# Altium schematic sheet sheet.SchDoc
size A4
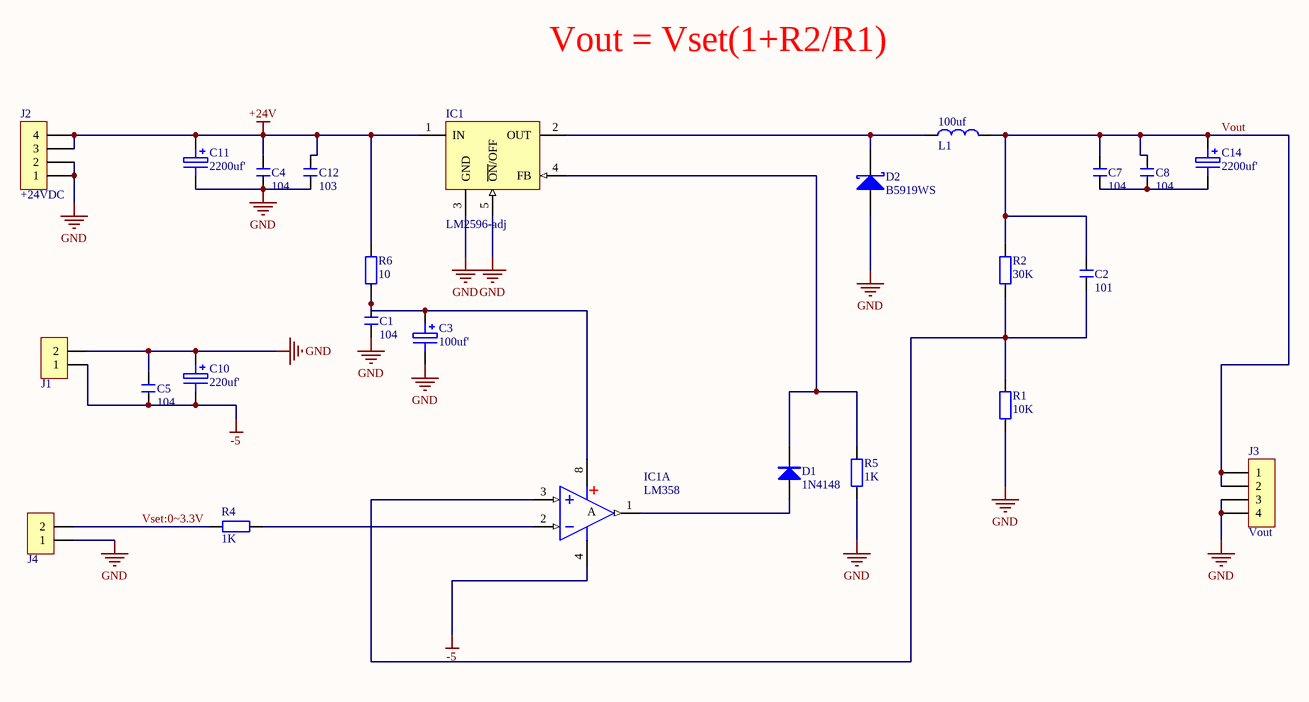
[diagram p0: sheet.SchDoc]

## Parts
(Parts that share a designator on the sheet are numbered #1, #2 ... from top to bottom, then left to right.)
100uf  L1  [CDRH74]
C1  104  [C 0805_L]
C2  101  [C 0805_L]
C3  100uf'  [RB.2/.4]
C4  104  [C 0805_L]
C5  104  [C 0805_L]
C7  104  [C 0805_L]
C8  104  [C 0805_L]
C10  220uf'  [RB.2/.4]
C11  2200uf'  [RB.2/.4]
C12  103  [C 0805_L]
C14  2200uf'  [RB.2/.4]
D1  1N4148  [MINI_MELF (LL34)]
D2  B5919WS  [SOD-323]
IC1#1  LM2596-adj  [TO220-5A]
IC1#2  LM358  [SOP8_N]  (part A of 2)
J1  HDR-1X2  [HDR2.54-M-LI-2P]  (value not drawn)
J2  +24VDC  [HDR2.54-LI-4P]
J3  Vout  [HDR2.54-LI-4P]
J4  HDR-1X2  [HDR2.54-M-LI-2P]  (value not drawn)
R1  10K  [R 0805_L]
R2  30K  [R 0805_L]
R4  1K  [R 0805_L]
R5  1K  [R 0805_L]
R6  10  [R 0805_L]

## Nets
+24V: C4.2 C11.1 C12.2 IC1#1.1(IN) J2.3 J2.4 R6.2
-5: C5.1 C10.2 IC1#2.4(V-) J1.1
GND: C1.1 C3.2 C4.1 C5.2 C10.1 C11.2 C12.1 D2.1(A) IC1#1.3(GND) IC1#1.5(~{ON}/OFF) J1.2 J2.1 J2.2 J3.3 J3.4 J4.1 R1.1 R5.2
Vout: 100uf.1 C2.2 C7.2 C8.2 C14.1 J3.1 J3.2 R2.2
Vset:0~3.3V: J4.2 R4.1
Net100uf_2: 100uf.2 D2.2(K) IC1#1.2(OUT)
NetC1_2: C1.2 C3.1 IC1#2.8(V+) R6.1
NetC2_1: C2.1 IC1#2.3(IN+) R1.2 R2.1
NetC7_1: C7.1 C8.1 C14.2
NetD1_1: D1.1(A) IC1#2.1(OUT)
NetD1_2: D1.2(K) IC1#1.4(FB) R5.1
NetIC1#2_2: IC1#2.2(IN-) R4.2

## Notes on the sheet
- Vout = Vset(1+R2/R1)
- (in symbol LM358, part A) A

## Library data of the parts
100uf = L1: 电感
C1 C2 C4 C5 C7 C8 C12 = C: 贴片电容; BOM名称: 无极性贴片电容; 淘宝ID: 封装库来自淘宝 ID：黄晶宝石; 联系售后，技术支持: https://shop463601444.taobao.com; 唯一出售店铺网址: https://shop463601444.taobao.com
C3 C10 C11 C14 = CAP-E: 电解电容
D1 = 1N4148: 开关二极管; BOM名称: 高速开关二极管; 淘宝ID: 封装库来自淘宝 ID：黄晶宝石; 欢迎光临: https://shop463601444.taobao.com
D2 = 1N5819: 肖特基二极管; 淘宝ID: 封装库来自淘宝 ID：黄晶宝石; 属性: 40V/2A; BOM名称: 肖特基二极管; 欢迎光临: https://shop463601444.taobao.com
IC1#1 = LM2596: DC降压芯片; BOM名称: DC稳压芯片; 版权归属: 源创客; 学习资源: www.ooocke.com
IC1#2 = LM358: 双路运放; 版权归属: 源创客; BOM名称: 双路运放; 封装库来自淘宝 ID：黄晶宝石: https://shop463601444.taobao.com
J1 J4 = Header 2: 2P接插件; 版权归属: 封装库来自淘宝 ID：黄晶宝石; BOM名称: 2P接插件; 联系售后: https://shop463601444.taobao.com
J2 J3 = CON4: Connector
R1 R2 R4-R6 = R: 贴片电阻; 版权归属: 来自淘宝 ID：黄晶宝石; 封装库来自淘宝卖家 ID：黄晶宝石: 其他店铺购入均为盗版，不享受售后技术支持服务，请立即申请退款; BOM名称: 贴片电阻; 联系售后: https://shop463601444.taobao.com